# Altium schematic sheet BMS_MAINBOARD.SchDoc
size D
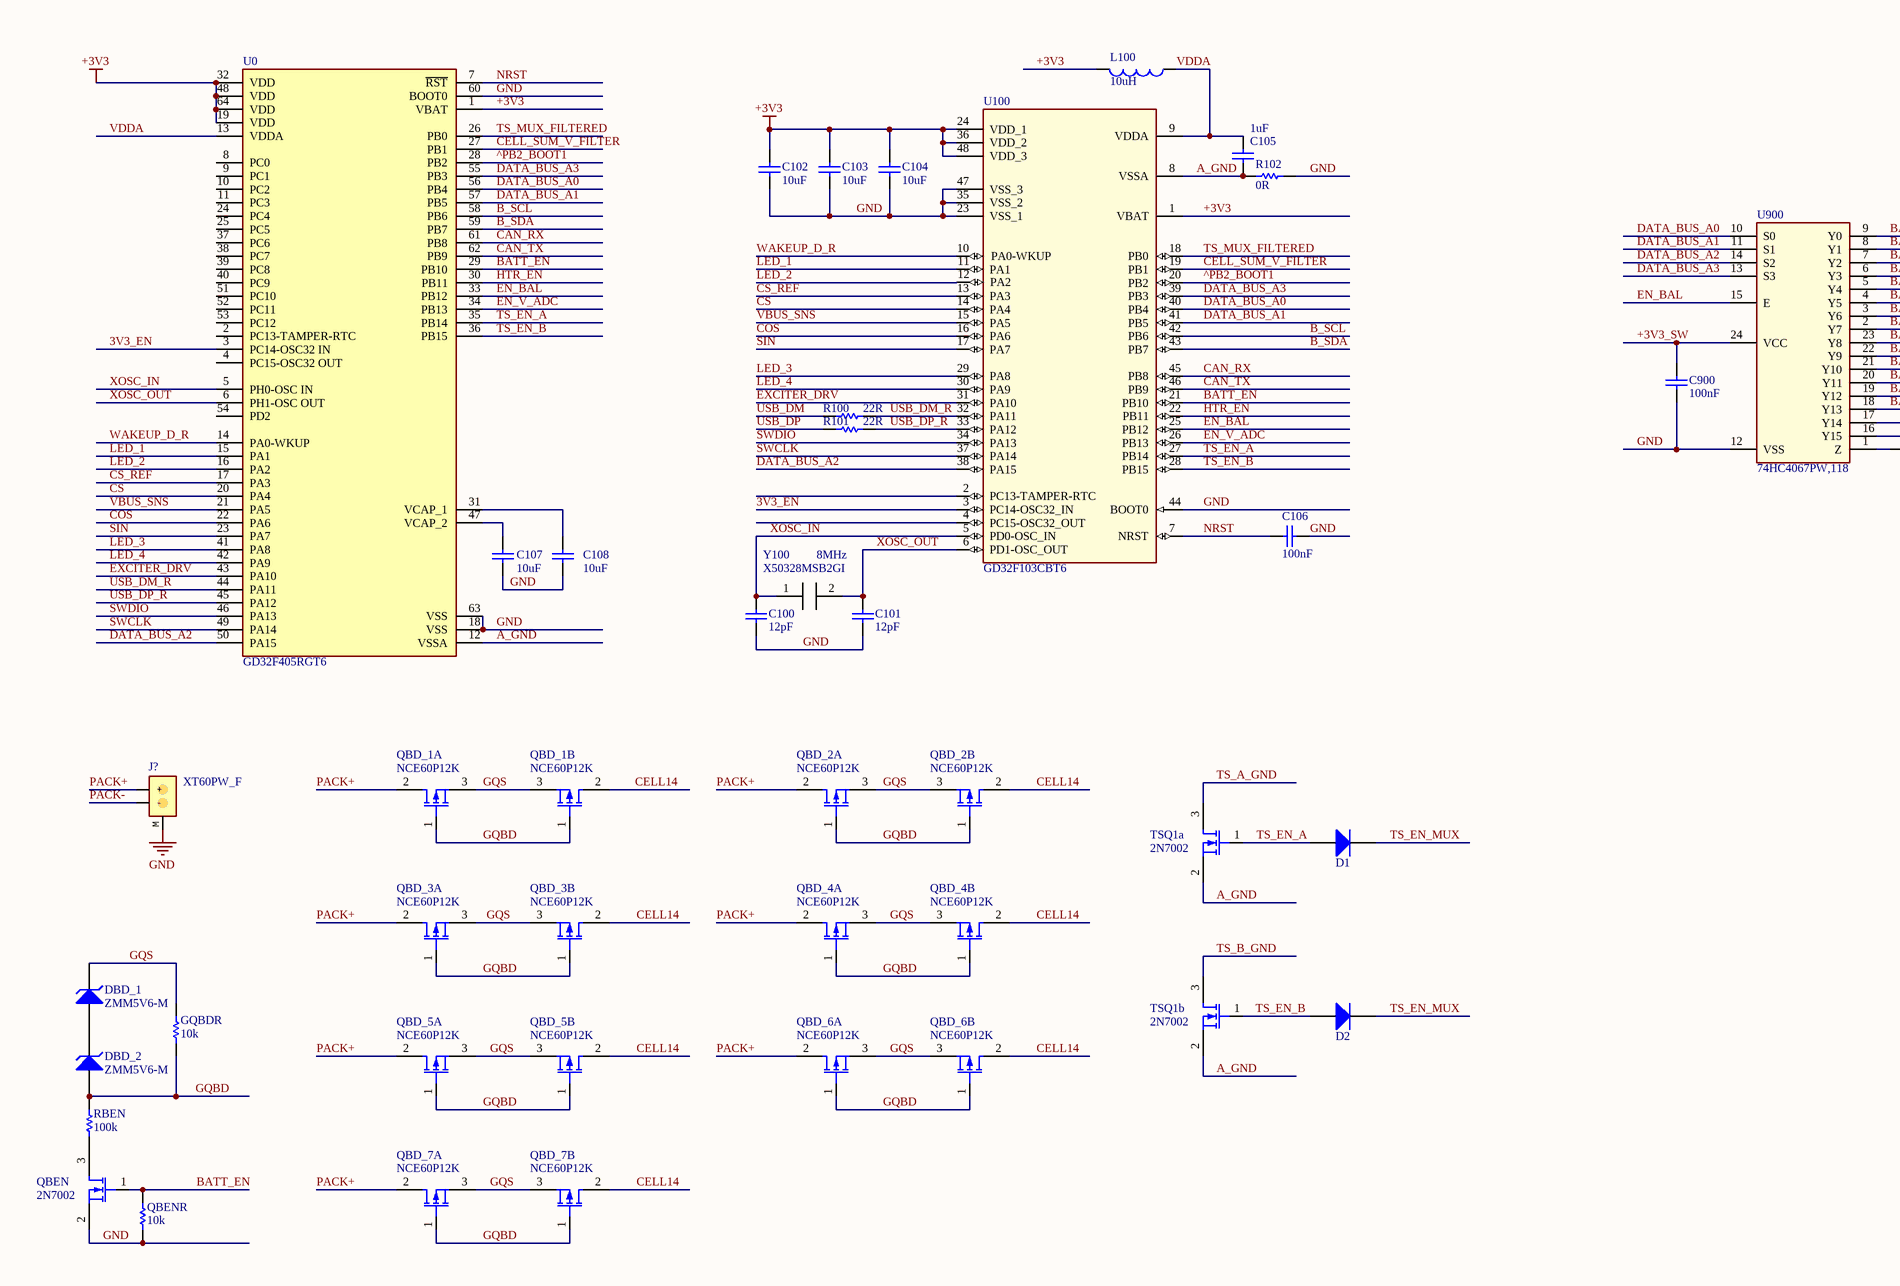
[diagram p0: BMS_MAINBOARD.SchDoc, top left]
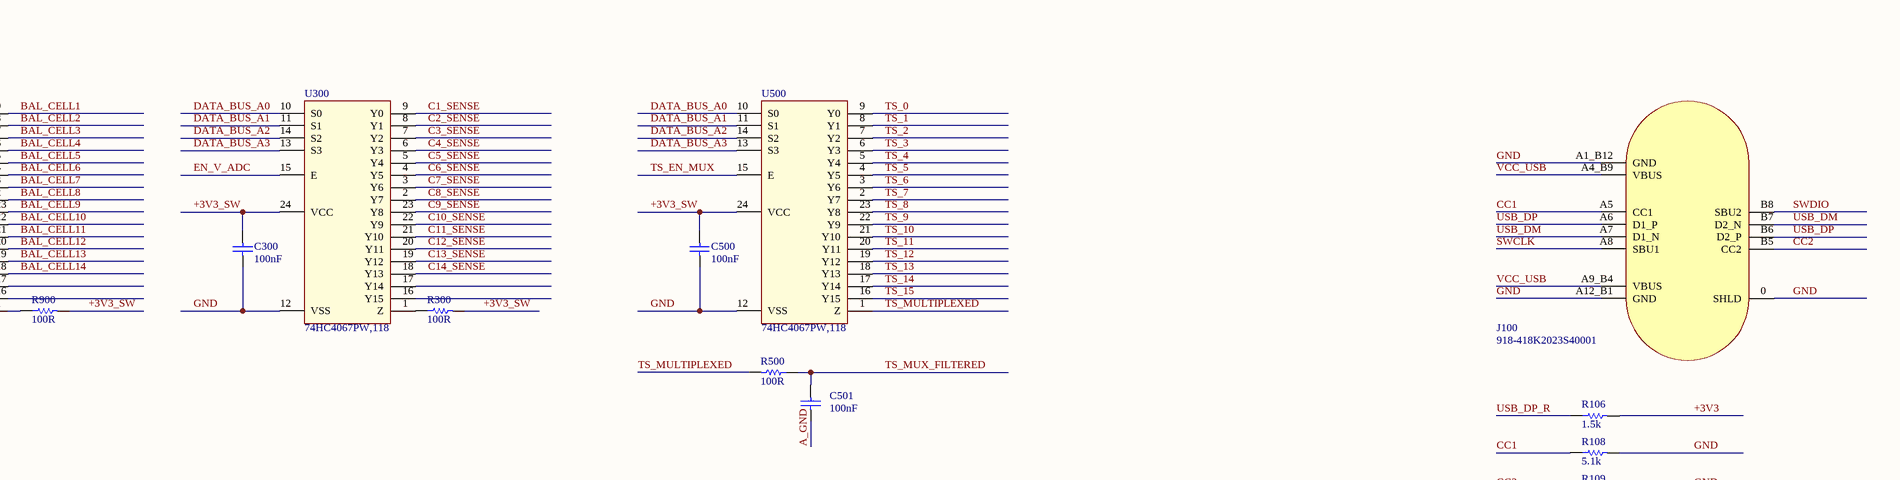
[diagram p1: BMS_MAINBOARD.SchDoc, top right]
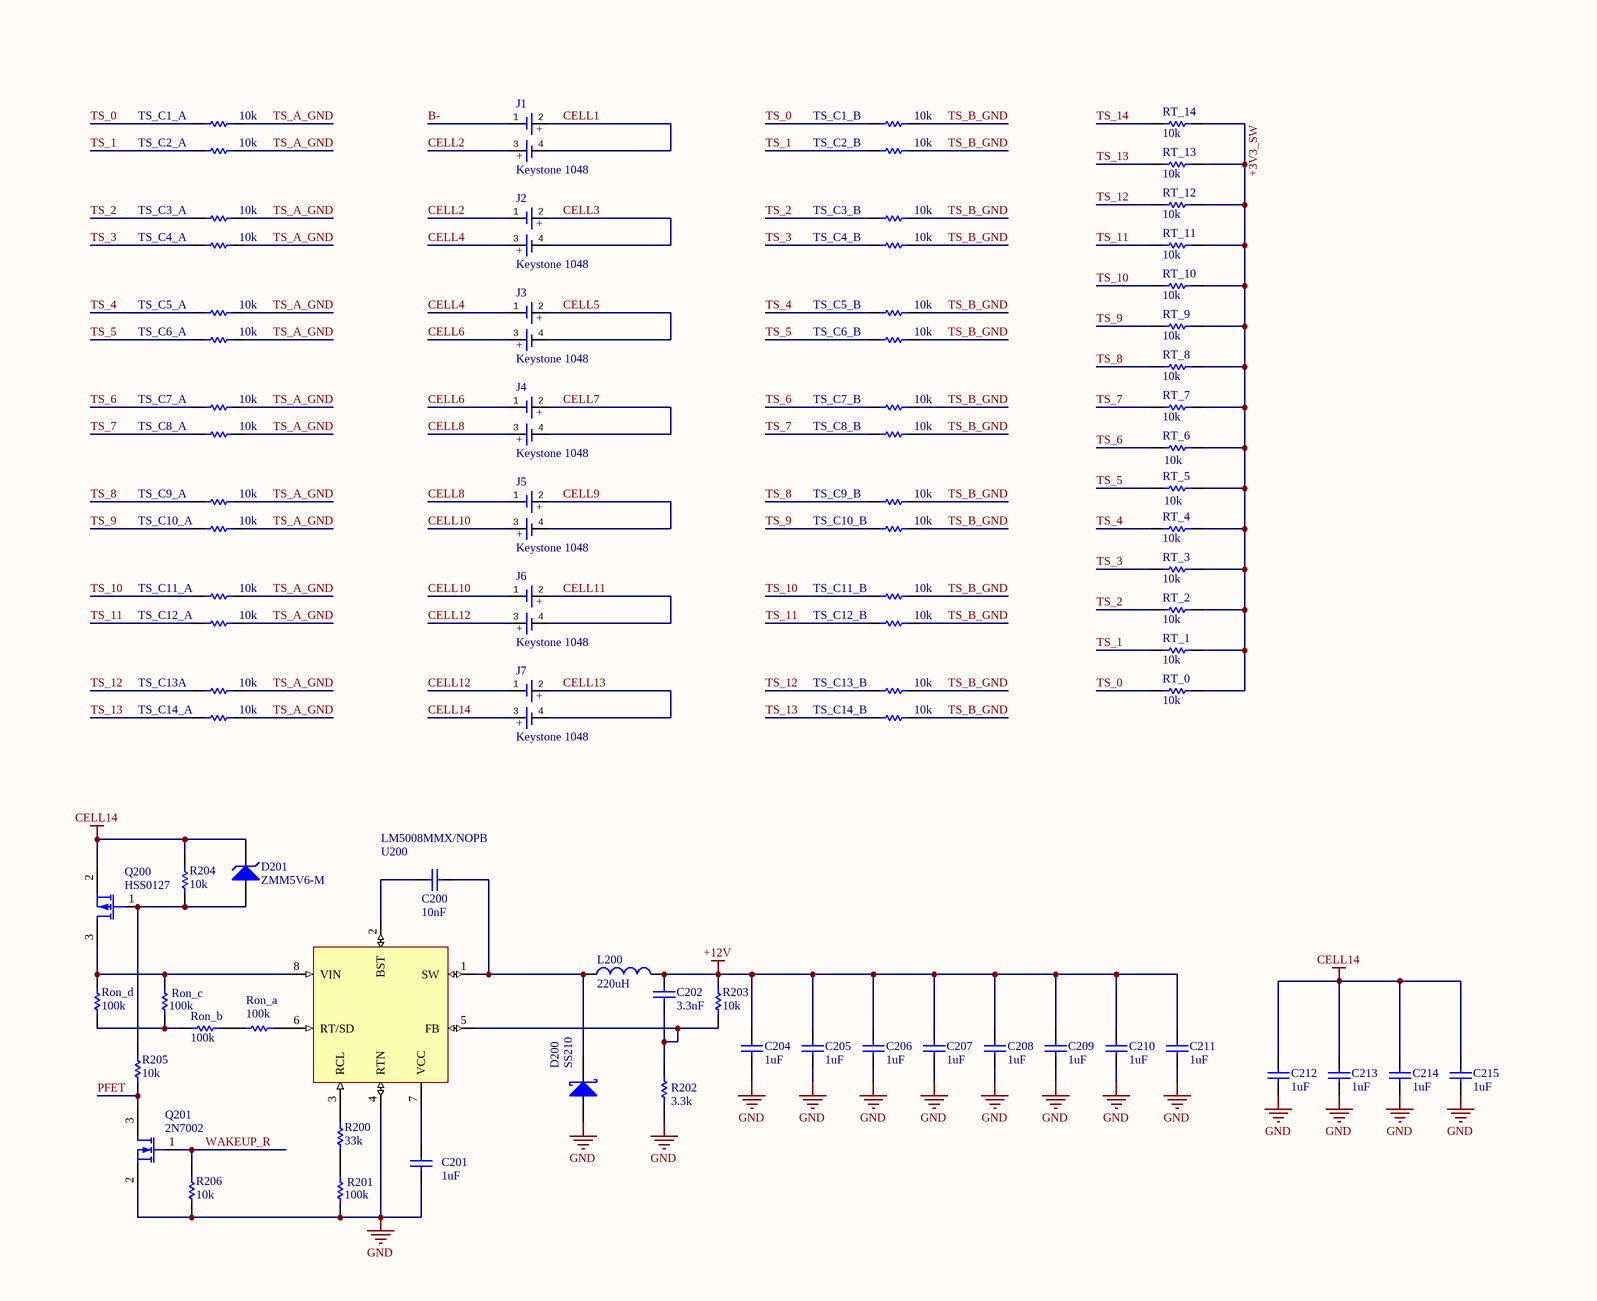
[diagram p2: BMS_MAINBOARD.SchDoc, bottom left]
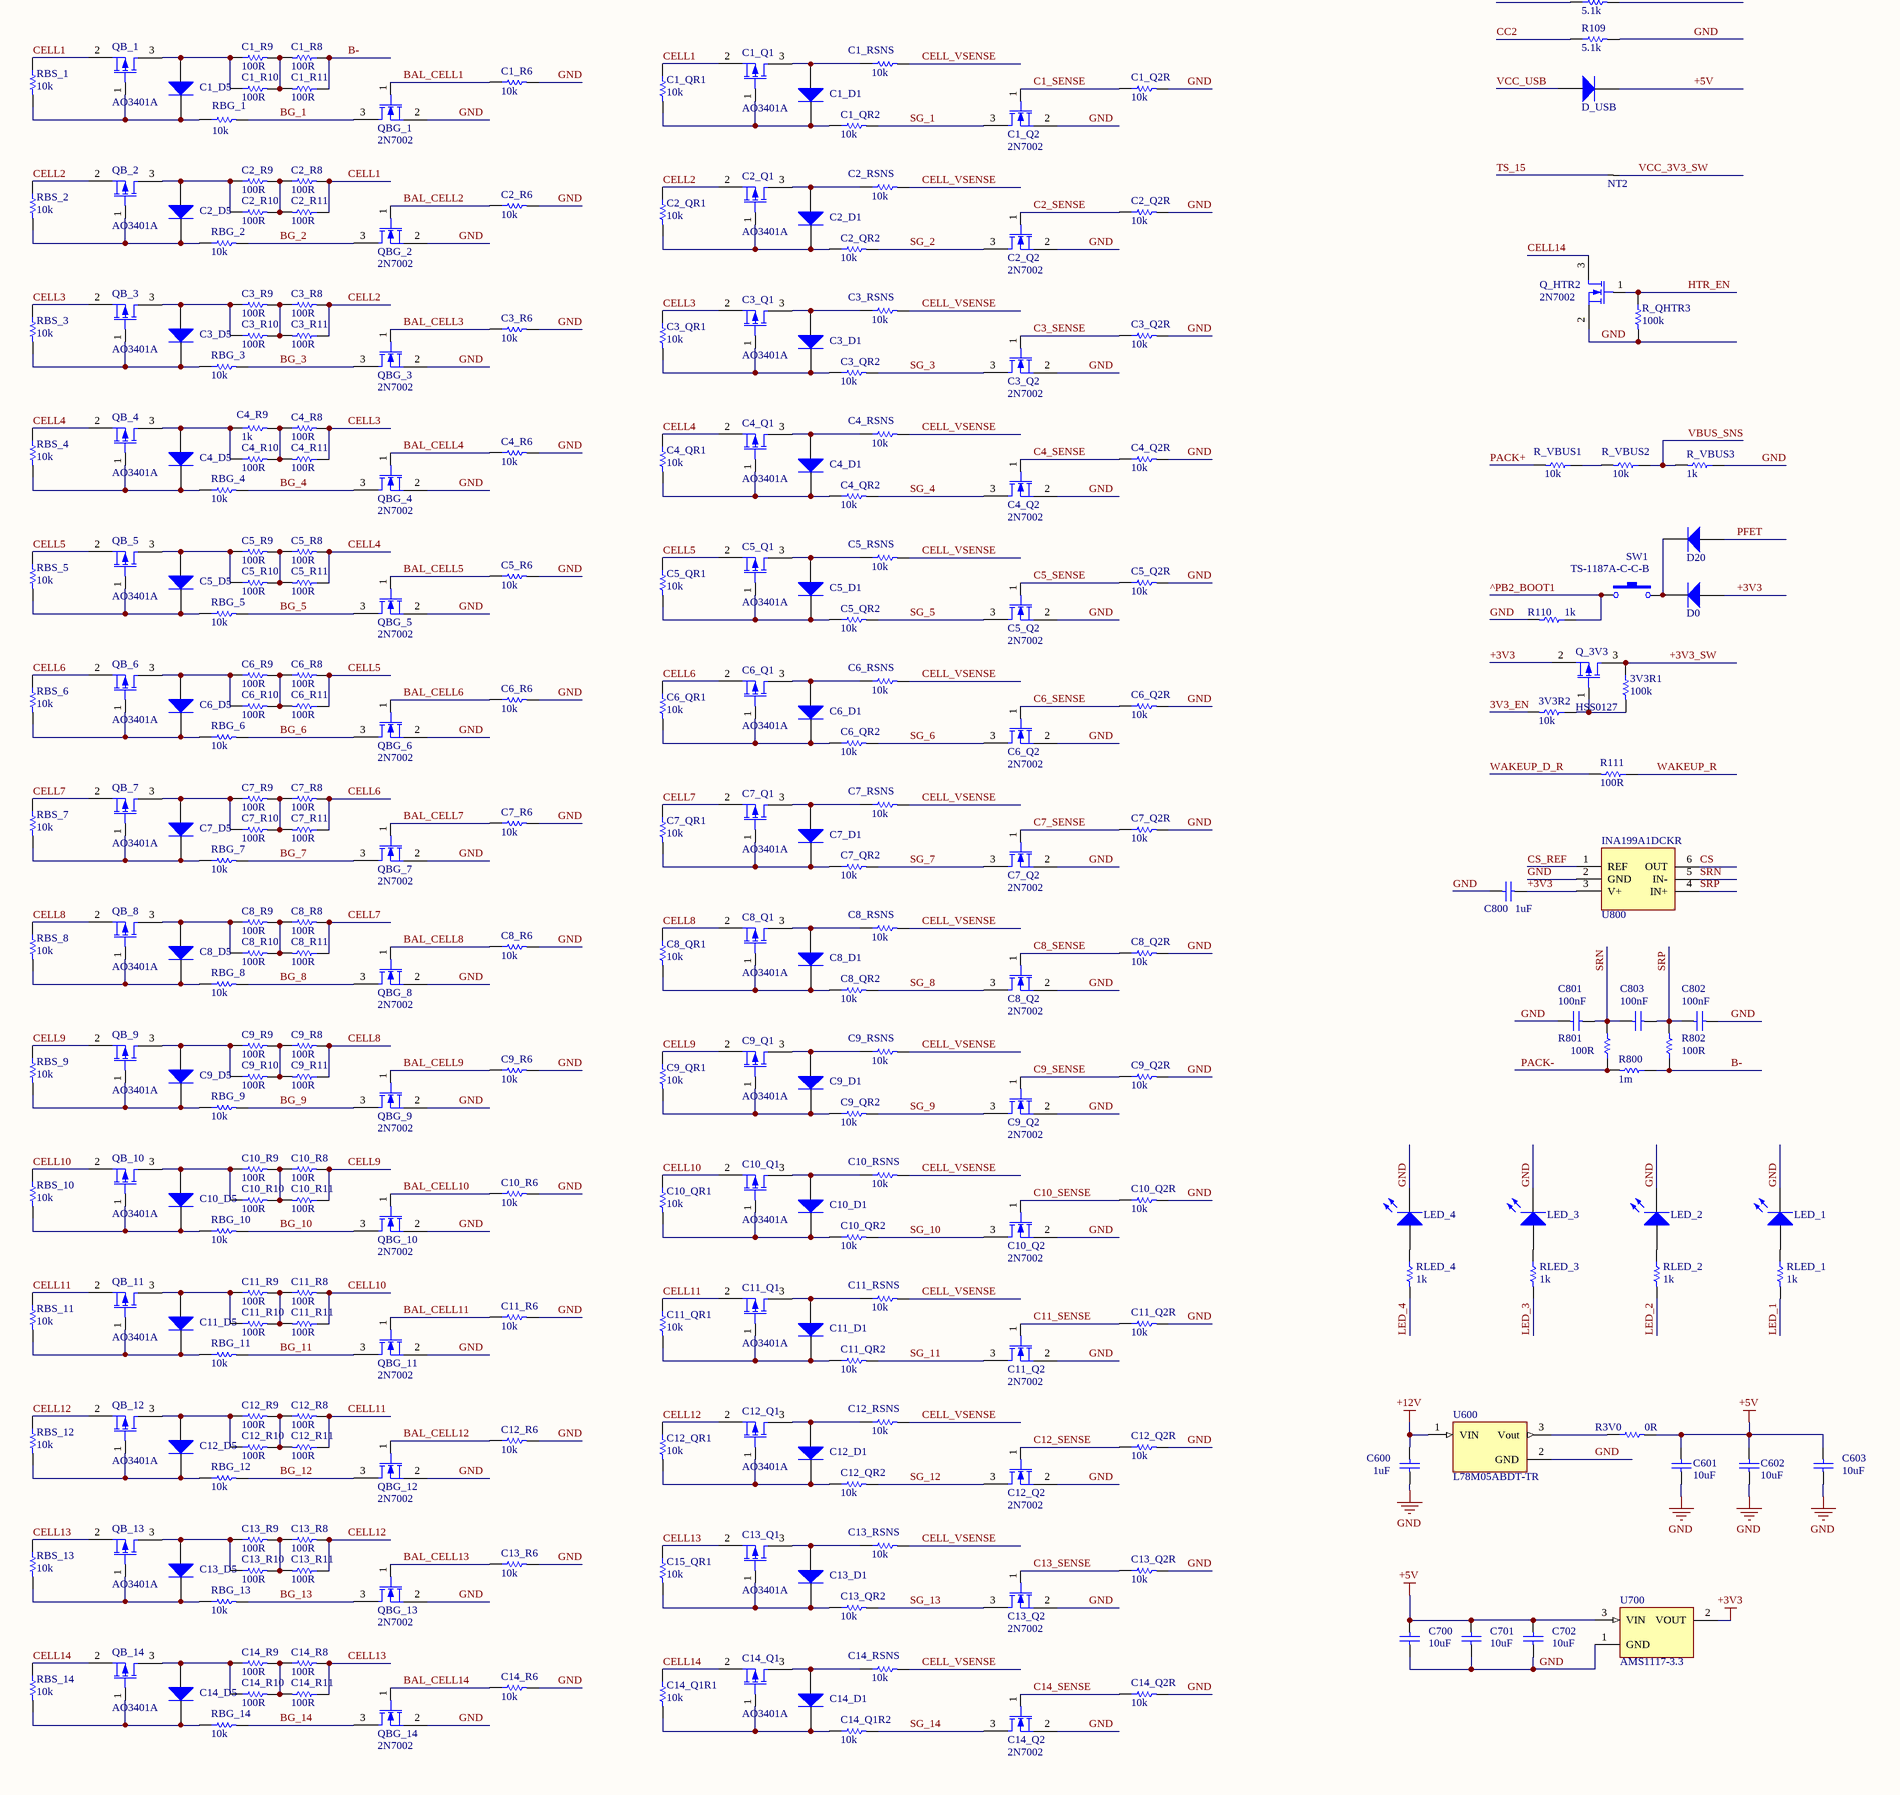
[diagram p3: BMS_MAINBOARD.SchDoc, bottom right]

## Parts
3V3R1  value 100k  [R_0402]  (hidden comment: 0402WGF1003TCE)
3V3R2  value 10k  [R_0402]  (hidden comment: 0402WGF1002TCE)
C1_D1  1N4148WS  [SOD-323]  (value not drawn)
C1_D5  1N4148WS  [SOD-323]  (value not drawn)
C1_Q1  AO3401A  [TO-236AB]
C1_Q2  2N7002  [TO-236AB]
C1_Q2R  value 10k  [R_0402]  (hidden comment: 0402WGF1002TCE)
C1_QR1  value 10k  [R_0402]  (hidden comment: 0402WGF1002TCE)
C1_QR2  value 10k  [R_0402]  (hidden comment: 0402WGF1002TCE)
C1_R6  value 10k  [R_0402]  (hidden comment: 0402WGF1002TCE)
C1_R8  value 100R  [R_0402]  (hidden comment: 0402WGF1000TCE)
C1_R9  value 100R  [R_0402]  (hidden comment: 0402WGF1000TCE)
C1_R10  value 100R  [R_0402]  (hidden comment: 0402WGF1000TCE)
C1_R11  value 100R  [R_0402]  (hidden comment: 0402WGF1000TCE)
C1_RSNS  value 10k  [R_0402]  (hidden comment: 0402WGF1002TCE)
C2_D1  1N4148WS  [SOD-323]  (value not drawn)
C2_D5  1N4148WS  [SOD-323]  (value not drawn)
C2_Q1  AO3401A  [TO-236AB]
C2_Q2  2N7002  [TO-236AB]
C2_Q2R  value 10k  [R_0402]  (hidden comment: 0402WGF1002TCE)
C2_QR1  value 10k  [R_0402]  (hidden comment: 0402WGF1002TCE)
C2_QR2  value 10k  [R_0402]  (hidden comment: 0402WGF1002TCE)
C2_R6  value 10k  [R_0402]  (hidden comment: 0402WGF1002TCE)
C2_R8  value 100R  [R_0402]  (hidden comment: 0402WGF1000TCE)
C2_R9  value 100R  [R_0402]  (hidden comment: 0402WGF1000TCE)
C2_R10  value 100R  [R_0402]  (hidden comment: 0402WGF1000TCE)
C2_R11  value 100R  [R_0402]  (hidden comment: 0402WGF1000TCE)
C2_RSNS  value 10k  [R_0402]  (hidden comment: 0402WGF1002TCE)
C3_D1  1N4148WS  [SOD-323]  (value not drawn)
C3_D5  1N4148WS  [SOD-323]  (value not drawn)
C3_Q1  AO3401A  [TO-236AB]
C3_Q2  2N7002  [TO-236AB]
C3_Q2R  value 10k  [R_0402]  (hidden comment: 0402WGF1002TCE)
C3_QR1  value 10k  [R_0402]  (hidden comment: 0402WGF1002TCE)
C3_QR2  value 10k  [R_0402]  (hidden comment: 0402WGF1002TCE)
C3_R6  value 10k  [R_0402]  (hidden comment: 0402WGF1002TCE)
C3_R8  value 100R  [R_0402]  (hidden comment: 0402WGF1000TCE)
C3_R9  value 100R  [R_0402]  (hidden comment: 0402WGF1000TCE)
C3_R10  value 100R  [R_0402]  (hidden comment: 0402WGF1000TCE)
C3_R11  value 100R  [R_0402]  (hidden comment: 0402WGF1000TCE)
C3_RSNS  value 10k  [R_0402]  (hidden comment: 0402WGF1002TCE)
C4_D1  1N4148WS  [SOD-323]  (value not drawn)
C4_D5  1N4148WS  [SOD-323]  (value not drawn)
C4_Q1  AO3401A  [TO-236AB]
C4_Q2  2N7002  [TO-236AB]
C4_Q2R  value 10k  [R_0402]  (hidden comment: 0402WGF1002TCE)
C4_QR1  value 10k  [R_0402]  (hidden comment: 0402WGF1002TCE)
C4_QR2  value 10k  [R_0402]  (hidden comment: 0402WGF1002TCE)
C4_R6  value 10k  [R_0402]  (hidden comment: 0402WGF1002TCE)
C4_R8  value 100R  [R_0402]  (hidden comment: 0402WGF1000TCE)
C4_R9  value 1k  [R_0402]  (hidden comment: 0402WGF1001TCE)
C4_R10  value 100R  [R_0402]  (hidden comment: 0402WGF1000TCE)
C4_R11  value 100R  [R_0402]  (hidden comment: 0402WGF1000TCE)
C4_RSNS  value 10k  [R_0402]  (hidden comment: 0402WGF1002TCE)
C5_D1  1N4148WS  [SOD-323]  (value not drawn)
C5_D5  1N4148WS  [SOD-323]  (value not drawn)
C5_Q1  AO3401A  [TO-236AB]
C5_Q2  2N7002  [TO-236AB]
C5_Q2R  value 10k  [R_0402]  (hidden comment: 0402WGF1002TCE)
C5_QR1  value 10k  [R_0402]  (hidden comment: 0402WGF1002TCE)
C5_QR2  value 10k  [R_0402]  (hidden comment: 0402WGF1002TCE)
C5_R6  value 10k  [R_0402]  (hidden comment: 0402WGF1002TCE)
C5_R8  value 100R  [R_0402]  (hidden comment: 0402WGF1000TCE)
C5_R9  value 100R  [R_0402]  (hidden comment: 0402WGF1000TCE)
C5_R10  value 100R  [R_0402]  (hidden comment: 0402WGF1000TCE)
C5_R11  value 100R  [R_0402]  (hidden comment: 0402WGF1000TCE)
C5_RSNS  value 10k  [R_0402]  (hidden comment: 0402WGF1002TCE)
C6_D1  1N4148WS  [SOD-323]  (value not drawn)
C6_D5  1N4148WS  [SOD-323]  (value not drawn)
C6_Q1  AO3401A  [TO-236AB]
C6_Q2  2N7002  [TO-236AB]
C6_Q2R  value 10k  [R_0402]  (hidden comment: 0402WGF1002TCE)
C6_QR1  value 10k  [R_0402]  (hidden comment: 0402WGF1002TCE)
C6_QR2  value 10k  [R_0402]  (hidden comment: 0402WGF1002TCE)
C6_R6  value 10k  [R_0402]  (hidden comment: 0402WGF1002TCE)
C6_R8  value 100R  [R_0402]  (hidden comment: 0402WGF1000TCE)
C6_R9  value 100R  [R_0402]  (hidden comment: 0402WGF1000TCE)
C6_R10  value 100R  [R_0402]  (hidden comment: 0402WGF1000TCE)
C6_R11  value 100R  [R_0402]  (hidden comment: 0402WGF1000TCE)
C6_RSNS  value 10k  [R_0402]  (hidden comment: 0402WGF1002TCE)
C7_D1  1N4148WS  [SOD-323]  (value not drawn)
C7_D5  1N4148WS  [SOD-323]  (value not drawn)
C7_Q1  AO3401A  [TO-236AB]
C7_Q2  2N7002  [TO-236AB]
C7_Q2R  value 10k  [R_0402]  (hidden comment: 0402WGF1002TCE)
C7_QR1  value 10k  [R_0402]  (hidden comment: 0402WGF1002TCE)
C7_QR2  value 10k  [R_0402]  (hidden comment: 0402WGF1002TCE)
C7_R6  value 10k  [R_0402]  (hidden comment: 0402WGF1002TCE)
C7_R8  value 100R  [R_0402]  (hidden comment: 0402WGF1000TCE)
C7_R9  value 100R  [R_0402]  (hidden comment: 0402WGF1000TCE)
C7_R10  value 100R  [R_0402]  (hidden comment: 0402WGF1000TCE)
C7_R11  value 100R  [R_0402]  (hidden comment: 0402WGF1000TCE)
C7_RSNS  value 10k  [R_0402]  (hidden comment: 0402WGF1002TCE)
C8_D1  1N4148WS  [SOD-323]  (value not drawn)
C8_D5  1N4148WS  [SOD-323]  (value not drawn)
C8_Q1  AO3401A  [TO-236AB]
C8_Q2  2N7002  [TO-236AB]
C8_Q2R  value 10k  [R_0402]  (hidden comment: 0402WGF1002TCE)
C8_QR1  value 10k  [R_0402]  (hidden comment: 0402WGF1002TCE)
C8_QR2  value 10k  [R_0402]  (hidden comment: 0402WGF1002TCE)
C8_R6  value 10k  [R_0402]  (hidden comment: 0402WGF1002TCE)
C8_R8  value 100R  [R_0402]  (hidden comment: 0402WGF1000TCE)
C8_R9  value 100R  [R_0402]  (hidden comment: 0402WGF1000TCE)
C8_R10  value 100R  [R_0402]  (hidden comment: 0402WGF1000TCE)
C8_R11  value 100R  [R_0402]  (hidden comment: 0402WGF1000TCE)
C8_RSNS  value 10k  [R_0402]  (hidden comment: 0402WGF1002TCE)
C9_D1  1N4148WS  [SOD-323]  (value not drawn)
C9_D5  1N4148WS  [SOD-323]  (value not drawn)
C9_Q1  AO3401A  [TO-236AB]
C9_Q2  2N7002  [TO-236AB]
C9_Q2R  value 10k  [R_0402]  (hidden comment: 0402WGF1002TCE)
C9_QR1  value 10k  [R_0402]  (hidden comment: 0402WGF1002TCE)
C9_QR2  value 10k  [R_0402]  (hidden comment: 0402WGF1002TCE)
C9_R6  value 10k  [R_0402]  (hidden comment: 0402WGF1002TCE)
C9_R8  value 100R  [R_0402]  (hidden comment: 0402WGF1000TCE)
C9_R9  value 100R  [R_0402]  (hidden comment: 0402WGF1000TCE)
C9_R10  value 100R  [R_0402]  (hidden comment: 0402WGF1000TCE)
C9_R11  value 100R  [R_0402]  (hidden comment: 0402WGF1000TCE)
C9_RSNS  value 10k  [R_0402]  (hidden comment: 0402WGF1002TCE)
C10_D1  1N4148WS  [SOD-323]  (value not drawn)
C10_D5  1N4148WS  [SOD-323]  (value not drawn)
C10_Q1  AO3401A  [TO-236AB]
C10_Q2  2N7002  [TO-236AB]
C10_Q2R  value 10k  [R_0402]  (hidden comment: 0402WGF1002TCE)
C10_QR1  value 10k  [R_0402]  (hidden comment: 0402WGF1002TCE)
C10_QR2  value 10k  [R_0402]  (hidden comment: 0402WGF1002TCE)
C10_R6  value 10k  [R_0402]  (hidden comment: 0402WGF1002TCE)
C10_R8  value 100R  [R_0402]  (hidden comment: 0402WGF1000TCE)
C10_R9  value 100R  [R_0402]  (hidden comment: 0402WGF1000TCE)
C10_R10  value 100R  [R_0402]  (hidden comment: 0402WGF1000TCE)
C10_R11  value 100R  [R_0402]  (hidden comment: 0402WGF1000TCE)
C10_RSNS  value 10k  [R_0402]  (hidden comment: 0402WGF1002TCE)
C11_D1  1N4148WS  [SOD-323]  (value not drawn)
C11_D5  1N4148WS  [SOD-323]  (value not drawn)
C11_Q1  AO3401A  [TO-236AB]
C11_Q2  2N7002  [TO-236AB]
C11_Q2R  value 10k  [R_0402]  (hidden comment: 0402WGF1002TCE)
C11_QR1  value 10k  [R_0402]  (hidden comment: 0402WGF1002TCE)
C11_QR2  value 10k  [R_0402]  (hidden comment: 0402WGF1002TCE)
C11_R6  value 10k  [R_0402]  (hidden comment: 0402WGF1002TCE)
C11_R8  value 100R  [R_0402]  (hidden comment: 0402WGF1000TCE)
C11_R9  value 100R  [R_0402]  (hidden comment: 0402WGF1000TCE)
C11_R10  value 100R  [R_0402]  (hidden comment: 0402WGF1000TCE)
C11_R11  value 100R  [R_0402]  (hidden comment: 0402WGF1000TCE)
C11_RSNS  value 10k  [R_0402]  (hidden comment: 0402WGF1002TCE)
C12_D1  1N4148WS  [SOD-323]  (value not drawn)
C12_D5  1N4148WS  [SOD-323]  (value not drawn)
C12_Q1  AO3401A  [TO-236AB]
C12_Q2  2N7002  [TO-236AB]
C12_Q2R  value 10k  [R_0402]  (hidden comment: 0402WGF1002TCE)
C12_QR1  value 10k  [R_0402]  (hidden comment: 0402WGF1002TCE)
C12_QR2  value 10k  [R_0402]  (hidden comment: 0402WGF1002TCE)
C12_R6  value 10k  [R_0402]  (hidden comment: 0402WGF1002TCE)
C12_R8  value 100R  [R_0402]  (hidden comment: 0402WGF1000TCE)
C12_R9  value 100R  [R_0402]  (hidden comment: 0402WGF1000TCE)
C12_R10  value 100R  [R_0402]  (hidden comment: 0402WGF1000TCE)
C12_R11  value 100R  [R_0402]  (hidden comment: 0402WGF1000TCE)
C12_RSNS  value 10k  [R_0402]  (hidden comment: 0402WGF1002TCE)
C13_D1  1N4148WS  [SOD-323]  (value not drawn)
C13_D5  1N4148WS  [SOD-323]  (value not drawn)
C13_Q1  AO3401A  [TO-236AB]
C13_Q2  2N7002  [TO-236AB]
C13_Q2R  value 10k  [R_0402]  (hidden comment: 0402WGF1002TCE)
C13_QR2  value 10k  [R_0402]  (hidden comment: 0402WGF1002TCE)
C13_R6  value 10k  [R_0402]  (hidden comment: 0402WGF1002TCE)
C13_R8  value 100R  [R_0402]  (hidden comment: 0402WGF1000TCE)
C13_R9  value 100R  [R_0402]  (hidden comment: 0402WGF1000TCE)
C13_R10  value 100R  [R_0402]  (hidden comment: 0402WGF1000TCE)
C13_R11  value 100R  [R_0402]  (hidden comment: 0402WGF1000TCE)
C13_RSNS  value 10k  [R_0402]  (hidden comment: 0402WGF1002TCE)
C14_D1  1N4148WS  [SOD-323]  (value not drawn)
C14_D5  1N4148WS  [SOD-323]  (value not drawn)
C14_Q1  AO3401A  [TO-236AB]
C14_Q1R1  value 10k  [R_0402]  (hidden comment: 0402WGF1002TCE)
C14_Q1R2  value 10k  [R_0402]  (hidden comment: 0402WGF1002TCE)
C14_Q2  2N7002  [TO-236AB]
C14_Q2R  value 10k  [R_0402]  (hidden comment: 0402WGF1002TCE)
C14_R6  value 10k  [R_0402]  (hidden comment: 0402WGF1002TCE)
C14_R8  value 100R  [R_0402]  (hidden comment: 0402WGF1000TCE)
C14_R9  value 100R  [R_0402]  (hidden comment: 0402WGF1000TCE)
C14_R10  value 100R  [R_0402]  (hidden comment: 0402WGF1000TCE)
C14_R11  value 100R  [R_0402]  (hidden comment: 0402WGF1000TCE)
C14_RSNS  value 10k  [R_0402]  (hidden comment: 0402WGF1002TCE)
C15_QR1  value 10k  [R_0402]  (hidden comment: 0402WGF1002TCE)
C100  value 12pF  [C_0402]  (hidden comment: 0402CG120J500NT)
C101  value 12pF  [C_0402]  (hidden comment: 0402CG120J500NT)
C102  value 10uF  [C_0402]  (hidden comment: CL05A106MQ5NUNC)
C103  value 10uF  [C_0402]  (hidden comment: CL05A106MQ5NUNC)
C104  value 10uF  [C_0402]  (hidden comment: CL05A106MQ5NUNC)
C105  value 1uF  [C_0402]  (hidden comment: CL05A105KA5NQNC)
C106  value 100nF  [C_0402]  (hidden comment: CL05B104KO5NNNC)
C107  value 10uF  [C_0402]  (hidden comment: CL05A106MQ5NUNC)
C108  value 10uF  [C_0402]  (hidden comment: CL05A106MQ5NUNC)
C200  value 10nF  [C_0402]  (hidden comment: CL05B103KB5NNNC)
C201  value 1uF  [C_0402]  (hidden comment: CL05A105KA5NQNC)
C202  value 3.3nF  [C_0402]  (hidden comment: CL05B332KB5NNNC)
C204  value 1uF  [C_0402]  (hidden comment: CL05A105KA5NQNC)
C205  value 1uF  [C_0402]  (hidden comment: CL05A105KA5NQNC)
C206  value 1uF  [C_0402]  (hidden comment: CL05A105KA5NQNC)
C207  value 1uF  [C_0402]  (hidden comment: CL05A105KA5NQNC)
C208  value 1uF  [C_0402]  (hidden comment: CL05A105KA5NQNC)
C209  value 1uF  [C_0402]  (hidden comment: CL05A105KA5NQNC)
C210  value 1uF  [C_0402]  (hidden comment: CL05A105KA5NQNC)
C211  value 1uF  [C_0402]  (hidden comment: CL05A105KA5NQNC)
C212  value 1uF  [C_1206]  (hidden comment: 1206B105K101NT)
C213  value 1uF  [C_1206]  (hidden comment: 1206B105K101NT)
C214  value 1uF  [C_1206]  (hidden comment: 1206B105K101NT)
C215  value 1uF  [C_1206]  (hidden comment: 1206B105K101NT)
C300  value 100nF  [C_0402]  (hidden comment: CL05B104KO5NNNC)
C500  value 100nF  [C_0402]  (hidden comment: CL05B104KO5NNNC)
C501  value 100nF  [C_0402]  (hidden comment: CL05B104KO5NNNC)
C600  value 1uF  [C_0402]  (hidden comment: CL05A105KA5NQNC)
C601  value 10uF  [C_0402]  (hidden comment: CL05A106MQ5NUNC)
C602  value 10uF  [C_0402]  (hidden comment: CL05A106MQ5NUNC)
C603  value 10uF  [C_0402]  (hidden comment: CL05A106MQ5NUNC)
C700  value 10uF  [C_0402]  (hidden comment: CL05A106MQ5NUNC)
C701  value 10uF  [C_0402]  (hidden comment: CL05A106MQ5NUNC)
C702  value 10uF  [C_0402]  (hidden comment: CL05A106MQ5NUNC)
C800  value 1uF  [C_0402]  (hidden comment: CL05A105KA5NQNC)
C801  value 100nF  [C_0402]  (hidden comment: CL05B104KO5NNNC)
C802  value 100nF  [C_0402]  (hidden comment: CL05B104KO5NNNC)
C803  value 100nF  [C_0402]  (hidden comment: CL05B104KO5NNNC)
C900  value 100nF  [C_0402]  (hidden comment: CL05B104KO5NNNC)
D0  1N4148WS  [SOD-323]  (value not drawn)
D1  1N4148WS  [SOD-323]  (value not drawn)
D2  1N4148WS  [SOD-323]  (value not drawn)
D20  1N4148WS  [SOD-323]  (value not drawn)
D200  SS210  [DO-214AC]
D201  ZMM5V6-M  [DO-213AA]
D_USB  1N4148WS  [SOD-323]  (value not drawn)
DBD_1  ZMM5V6-M  [DO-213AA]
DBD_2  ZMM5V6-M  [DO-213AA]
GQBDR  value 10k  [R_0402]  (hidden comment: 0402WGF1002TCE)
J1  Keystone 1048  [Keystone 1048]
J2  Keystone 1048  [Keystone 1048]
J3  Keystone 1048  [Keystone 1048]
J4  Keystone 1048  [Keystone 1048]
J5  Keystone 1048  [Keystone 1048]
J6  Keystone 1048  [Keystone 1048]
J7  Keystone 1048  [Keystone 1048]
J100  918-418K2023S40001  [DX07S016JA1R1500]
J?  XT60PW_F  [XT60PW_F]
L100  value 10uH  [L_0603]  (hidden comment: SDFL1608S100KTF)
L200  value 220uH  [SRR1260]  (hidden comment: SWRB1207S-221MT)
LED_1  19-21UYC/S530-A4/TR8  [D_0603]  (value not drawn)
LED_2  19-21UYC/S530-A4/TR8  [D_0603]  (value not drawn)
LED_3  19-21UYC/S530-A4/TR8  [D_0603]  (value not drawn)
LED_4  19-21UYC/S530-A4/TR8  [D_0603]  (value not drawn)
NT2  0  [NET_TIE]  (value not drawn)
Q200  HSS0127  [TO-236AB]
Q201  2N7002  [TO-236AB]
Q_3V3  HSS0127  [TO-236AB]
Q_HTR2  2N7002  [TO-236AB]
QB_1  AO3401A  [TO-236AB]
QB_2  AO3401A  [TO-236AB]
QB_3  AO3401A  [TO-236AB]
QB_4  AO3401A  [TO-236AB]
QB_5  AO3401A  [TO-236AB]
QB_6  AO3401A  [TO-236AB]
QB_7  AO3401A  [TO-236AB]
QB_8  AO3401A  [TO-236AB]
QB_9  AO3401A  [TO-236AB]
QB_10  AO3401A  [TO-236AB]
QB_11  AO3401A  [TO-236AB]
QB_12  AO3401A  [TO-236AB]
QB_13  AO3401A  [TO-236AB]
QB_14  AO3401A  [TO-236AB]
QBD_1A  NCE60P12K  [TO-252AA]
QBD_1B  NCE60P12K  [TO-252AA]
QBD_2A  NCE60P12K  [TO-252AA]
QBD_2B  NCE60P12K  [TO-252AA]
QBD_3A  NCE60P12K  [TO-252AA]
QBD_3B  NCE60P12K  [TO-252AA]
QBD_4A  NCE60P12K  [TO-252AA]
QBD_4B  NCE60P12K  [TO-252AA]
QBD_5A  NCE60P12K  [TO-252AA]
QBD_5B  NCE60P12K  [TO-252AA]
QBD_6A  NCE60P12K  [TO-252AA]
QBD_6B  NCE60P12K  [TO-252AA]
QBD_7A  NCE60P12K  [TO-252AA]
QBD_7B  NCE60P12K  [TO-252AA]
QBEN  2N7002  [TO-236AB]
QBENR  value 10k  [R_0402]  (hidden comment: 0402WGF1002TCE)
QBG_1  2N7002  [TO-236AB]
QBG_2  2N7002  [TO-236AB]
QBG_3  2N7002  [TO-236AB]
QBG_4  2N7002  [TO-236AB]
QBG_5  2N7002  [TO-236AB]
QBG_6  2N7002  [TO-236AB]
QBG_7  2N7002  [TO-236AB]
QBG_8  2N7002  [TO-236AB]
QBG_9  2N7002  [TO-236AB]
QBG_10  2N7002  [TO-236AB]
QBG_11  2N7002  [TO-236AB]
QBG_12  2N7002  [TO-236AB]
QBG_13  2N7002  [TO-236AB]
QBG_14  2N7002  [TO-236AB]
R3V0  value 0R  [R_0402]  (hidden comment: 0402WGF0000TCE)
R100  value 22R  [R_0402]  (hidden comment: 0402WGF220JTCE)
R101  value 22R  [R_0402]  (hidden comment: 0402WGF220JTCE)
R102  value 0R  [R_0402]  (hidden comment: 0402WGF0000TCE)
R106  value 1.5k  [R_0402]  (hidden comment: 0402WGF1501TCE)
R108  value 5.1k  [R_0402]  (hidden comment: 0402WGF5101TCE)
R109  value 5.1k  [R_0402]  (hidden comment: 0402WGF5101TCE)
R110  value 1k  [R_0402]  (hidden comment: 0402WGF1001TCE)
R111  value 100R  [R_0402]  (hidden comment: 0402WGF1000TCE)
R200  value 33k  [R_0402]  (hidden comment: 0402WGF3302TCE)
R201  value 100k  [R_0402]  (hidden comment: 0402WGF1003TCE)
R202  value 3.3k  [R_0402]  (hidden comment: 0402WGF3301TCE)
R203  value 10k  [R_0402]  (hidden comment: 0402WGF1002TCE)
R204  value 10k  [R_0402]  (hidden comment: 0402WGF1002TCE)
R205  value 10k  [R_0402]  (hidden comment: 0402WGF1002TCE)
R206  value 10k  [R_0402]  (hidden comment: 0402WGF1002TCE)
R300  value 100R  [R_0402]  (hidden comment: 0402WGF1000TCE)
R500  value 100R  [R_0402]  (hidden comment: 0402WGF1000TCE)
R800  1m  [R_2512]
R801  value 100R  [R_0402]  (hidden comment: 0402WGF1000TCE)
R802  value 100R  [R_0402]  (hidden comment: 0402WGF1000TCE)
R900  value 100R  [R_0402]  (hidden comment: 0402WGF1000TCE)
R_QHTR3  value 100k  [R_0402]  (hidden comment: 0402WGF1003TCE)
R_VBUS1  value 10k  [R_0402]  (hidden comment: 0402WGF1002TCE)
R_VBUS2  value 10k  [R_0402]  (hidden comment: 0402WGF1002TCE)
R_VBUS3  value 1k  [R_0402]  (hidden comment: 0402WGF1001TCE)
RBEN  value 100k  [R_0402]  (hidden comment: 0402WGF1003TCE)
RBG_1  value 10k  [R_0402]  (hidden comment: 0402WGF1002TCE)
RBG_2  value 10k  [R_0402]  (hidden comment: 0402WGF1002TCE)
RBG_3  value 10k  [R_0402]  (hidden comment: 0402WGF1002TCE)
RBG_4  value 10k  [R_0402]  (hidden comment: 0402WGF1002TCE)
RBG_5  value 10k  [R_0402]  (hidden comment: 0402WGF1002TCE)
RBG_6  value 10k  [R_0402]  (hidden comment: 0402WGF1002TCE)
RBG_7  value 10k  [R_0402]  (hidden comment: 0402WGF1002TCE)
RBG_8  value 10k  [R_0402]  (hidden comment: 0402WGF1002TCE)
RBG_9  value 10k  [R_0402]  (hidden comment: 0402WGF1002TCE)
RBG_10  value 10k  [R_0402]  (hidden comment: 0402WGF1002TCE)
RBG_11  value 10k  [R_0402]  (hidden comment: 0402WGF1002TCE)
RBG_12  value 10k  [R_0402]  (hidden comment: 0402WGF1002TCE)
RBG_13  value 10k  [R_0402]  (hidden comment: 0402WGF1002TCE)
RBG_14  value 10k  [R_0402]  (hidden comment: 0402WGF1002TCE)
RBS_1  value 10k  [R_0402]  (hidden comment: 0402WGF1002TCE)
RBS_2  value 10k  [R_0402]  (hidden comment: 0402WGF1002TCE)
RBS_3  value 10k  [R_0402]  (hidden comment: 0402WGF1002TCE)
RBS_4  value 10k  [R_0402]  (hidden comment: 0402WGF1002TCE)
RBS_5  value 10k  [R_0402]  (hidden comment: 0402WGF1002TCE)
RBS_6  value 10k  [R_0402]  (hidden comment: 0402WGF1002TCE)
RBS_7  value 10k  [R_0402]  (hidden comment: 0402WGF1002TCE)
RBS_8  value 10k  [R_0402]  (hidden comment: 0402WGF1002TCE)
RBS_9  value 10k  [R_0402]  (hidden comment: 0402WGF1002TCE)
RBS_10  value 10k  [R_0402]  (hidden comment: 0402WGF1002TCE)
RBS_11  value 10k  [R_0402]  (hidden comment: 0402WGF1002TCE)
RBS_12  value 10k  [R_0402]  (hidden comment: 0402WGF1002TCE)
RBS_13  value 10k  [R_0402]  (hidden comment: 0402WGF1002TCE)
RBS_14  value 10k  [R_0402]  (hidden comment: 0402WGF1002TCE)
RLED_1  value 1k  [R_0402]  (hidden comment: 0402WGF1001TCE)
RLED_2  value 1k  [R_0402]  (hidden comment: 0402WGF1001TCE)
RLED_3  value 1k  [R_0402]  (hidden comment: 0402WGF1001TCE)
RLED_4  value 1k  [R_0402]  (hidden comment: 0402WGF1001TCE)
Ron_a  value 100k  [R_0402]  (hidden comment: 0402WGF1003TCE)
Ron_b  value 100k  [R_0402]  (hidden comment: 0402WGF1003TCE)
Ron_c  value 100k  [R_0402]  (hidden comment: 0402WGF1003TCE)
Ron_d  value 100k  [R_0402]  (hidden comment: 0402WGF1003TCE)
RT_0  value 10k  [R_0402]  (hidden comment: 0402WGF1002TCE)
RT_1  value 10k  [R_0402]  (hidden comment: 0402WGF1002TCE)
RT_2  value 10k  [R_0402]  (hidden comment: 0402WGF1002TCE)
RT_3  value 10k  [R_0402]  (hidden comment: 0402WGF1002TCE)
RT_4  value 10k  [R_0402]  (hidden comment: 0402WGF1002TCE)
RT_5  value 10k  [R_0402]  (hidden comment: 0402WGF1002TCE)
RT_6  value 10k  [R_0402]  (hidden comment: 0402WGF1002TCE)
RT_7  value 10k  [R_0402]  (hidden comment: 0402WGF1002TCE)
RT_8  value 10k  [R_0402]  (hidden comment: 0402WGF1002TCE)
RT_9  value 10k  [R_0402]  (hidden comment: 0402WGF1002TCE)
RT_10  value 10k  [R_0402]  (hidden comment: 0402WGF1002TCE)
RT_11  value 10k  [R_0402]  (hidden comment: 0402WGF1002TCE)
RT_12  value 10k  [R_0402]  (hidden comment: 0402WGF1002TCE)
RT_13  value 10k  [R_0402]  (hidden comment: 0402WGF1002TCE)
RT_14  value 10k  [R_0402]  (hidden comment: 0402WGF1002TCE)
SW1  TS-1187A-C-C-B  [TS-1187A-C-C-B]
TS_C1_A  value 10k  [R_0402]  (hidden comment: NCP15XH103F03RC)
TS_C1_B  value 10k  [R_0402]  (hidden comment: NCP15XH103F03RC)
TS_C2_A  value 10k  [R_0402]  (hidden comment: NCP15XH103F03RC)
TS_C2_B  value 10k  [R_0402]  (hidden comment: NCP15XH103F03RC)
TS_C3_A  value 10k  [R_0402]  (hidden comment: NCP15XH103F03RC)
TS_C3_B  value 10k  [R_0402]  (hidden comment: NCP15XH103F03RC)
TS_C4_A  value 10k  [R_0402]  (hidden comment: NCP15XH103F03RC)
TS_C4_B  value 10k  [R_0402]  (hidden comment: NCP15XH103F03RC)
TS_C5_A  value 10k  [R_0402]  (hidden comment: NCP15XH103F03RC)
TS_C5_B  value 10k  [R_0402]  (hidden comment: NCP15XH103F03RC)
TS_C6_A  value 10k  [R_0402]  (hidden comment: NCP15XH103F03RC)
TS_C6_B  value 10k  [R_0402]  (hidden comment: NCP15XH103F03RC)
TS_C7_A  value 10k  [R_0402]  (hidden comment: NCP15XH103F03RC)
TS_C7_B  value 10k  [R_0402]  (hidden comment: NCP15XH103F03RC)
TS_C8_A  value 10k  [R_0402]  (hidden comment: NCP15XH103F03RC)
TS_C8_B  value 10k  [R_0402]  (hidden comment: NCP15XH103F03RC)
TS_C9_A  value 10k  [R_0402]  (hidden comment: NCP15XH103F03RC)
TS_C9_B  value 10k  [R_0402]  (hidden comment: NCP15XH103F03RC)
TS_C10_A  value 10k  [R_0402]  (hidden comment: NCP15XH103F03RC)
TS_C10_B  value 10k  [R_0402]  (hidden comment: NCP15XH103F03RC)
TS_C11_A  value 10k  [R_0402]  (hidden comment: NCP15XH103F03RC)
TS_C11_B  value 10k  [R_0402]  (hidden comment: NCP15XH103F03RC)
TS_C12_A  value 10k  [R_0402]  (hidden comment: NCP15XH103F03RC)
TS_C12_B  value 10k  [R_0402]  (hidden comment: NCP15XH103F03RC)
TS_C13_B  value 10k  [R_0402]  (hidden comment: NCP15XH103F03RC)
TS_C13A  value 10k  [R_0402]  (hidden comment: NCP15XH103F03RC)
TS_C14_A  value 10k  [R_0402]  (hidden comment: NCP15XH103F03RC)
TS_C14_B  value 10k  [R_0402]  (hidden comment: NCP15XH103F03RC)
TSQ1a  2N7002  [TO-236AB]
TSQ1b  2N7002  [TO-236AB]
U0  GD32F405RGT6  [QFP-64-P0.5MM]
U100  GD32F103CBT6  [QFP-48-P0.5MM]
U200  LM5008MMX/NOPB  [SOP65P490X110-8N]
U300  74HC4067PW,118  [TSSOP-24-P0.65MM-W4.4MM]
U500  74HC4067PW,118  [TSSOP-24-P0.65MM-W4.4MM]
U600  L78M05ABDT-TR  [TO-252AA]
U700  AMS1117-3.3  [TO-261AA]
U800  INA199A1DCKR  [SOT-353-6]
U900  74HC4067PW,118  [TSSOP-24-P0.65MM-W4.4MM]
Y100  X50328MSB2GI  value 8MHz  [YSX530GA]

## Nets
+3V3: C102.2 C103.2 C104.2 C800.1 D0.2(A) L100.2 Q_3V3.2(S) R106.2 U0.1(VBAT) U0.19(VDD) U0.32(VDD) U0.48(VDD) U0.64(VDD) U100.1(VBAT) U100.24(VDD_1) U100.36(VDD_2) U100.48(VDD_3) U700.2(VOUT) U800.3(V+)
+5V: C601.2 C602.2 C603.2 C700.2 C701.2 C702.2 D_USB.1(K) R3V0.2 U700.3(VIN)
+12V: C202.2 C204.1 C205.1 C206.1 C207.1 C208.1 C209.1 C210.1 C211.1 C600.2 L200.2 R203.1 U600.1(VIN)
CELL14: C14_Q1.2(S) C14_Q1R1.1 C212.2 C213.2 C214.2 C215.2 D201.1(K) J7.3 Q200.2(S) Q_HTR2.3(D) QB_14.2(S) QBD_1B.2(D) QBD_2B.2(D) QBD_3B.2(D) QBD_4B.2(D) QBD_5B.2(D) QBD_6B.2(D) QBD_7B.2(D) R204.1 RBS_14.1
GND: C1_Q2.2(S) C1_Q2R.2 C1_R6.2 C2_Q2.2(S) C2_Q2R.2 C2_R6.2 C3_Q2.2(S) C3_Q2R.2 C3_R6.2 C4_Q2.2(S) C4_Q2R.2 C4_R6.2 C5_Q2.2(S) C5_Q2R.2 C5_R6.2 C6_Q2.2(S) C6_Q2R.2 C6_R6.2 C7_Q2.2(S) C7_Q2R.2 C7_R6.2 C8_Q2.2(S) C8_Q2R.2 C8_R6.2 C9_Q2.2(S) C9_Q2R.2 C9_R6.2 C10_Q2.2(S) C10_Q2R.2 C10_R6.2 C11_Q2.2(S) C11_Q2R.2 C11_R6.2 C12_Q2.2(S) C12_Q2R.2 C12_R6.2 C13_Q2.2(S) C13_Q2R.2 C13_R6.2 C14_Q2.2(S) C14_Q2R.2 C14_R6.2 C100.1 C101.1 C102.1 C103.1 C104.1 C106.1 C107.1 C108.1 C201.2 C204.2 C205.2 C206.2 C207.2 C208.2 C209.2 C210.2 C211.2 C212.1 C213.1 C214.1 C215.1 C300.1 C500.1 C600.1 C601.1 C602.1 C603.1 C700.1 C701.1 C702.1 C800.2 C801.1 C802.2 C900.1 D200.2(A) J100.0(SHLD) J100.A1_B12(GND) J100.A12_B1(GND) J?.M LED_1.1(K) LED_2.1(K) LED_3.1(K) LED_4.1(K) Q201.2(S) Q_HTR2.2(S) QBEN.2(S) QBENR.2 QBG_1.2(S) QBG_2.2(S) QBG_3.2(S) QBG_4.2(S) QBG_5.2(S) QBG_6.2(S) QBG_7.2(S) QBG_8.2(S) QBG_9.2(S) QBG_10.2(S) QBG_11.2(S) QBG_12.2(S) QBG_13.2(S) QBG_14.2(S) R102.1 R108.2 R109.2 R110.2 R201.1 R202.1 R206.2 R_QHTR3.2 R_VBUS3.1 U0.18(VSS) U0.60(BOOT0) U0.63(VSS) U100.23(VSS_1) U100.35(VSS_2) U100.44(BOOT0) U100.47(VSS_3) U200.4(RTN) U300.12(VSS) U500.12(VSS) U600.2(GND) U700.1(GND) U800.2(GND) U900.12(VSS)
3V3_EN: 3V3R2.2 U0.3(PC14-OSC32_IN) U100.3(PC14-OSC32_IN)
+3V3_SW: 3V3R1.1 C300.2 C500.2 C900.2 Q_3V3.3(D) R300.2 R900.2 RT_0.2 RT_1.2 RT_2.2 RT_3.2 RT_4.2 RT_5.2 RT_6.2 RT_7.2 RT_8.2 RT_9.2 RT_10.2 RT_11.2 RT_12.2 RT_13.2 RT_14.2 U300.24(VCC) U500.24(VCC) U900.24(VCC)
^PB2_BOOT1: R110.1 SW1.1 U0.28(PB2) U100.20(PB2)
A_GND: C105.1 C501.1 R102.2 TSQ1a.2(S) TSQ1b.2(S) U0.12(VSSA) U100.8(VSSA)
B-: C1_R8.1 C1_R11.1 J1.1 R800.1 R802.1
B_SCL: U0.58(PB6) U100.42(PB6)
B_SDA: U0.59(PB7) U100.43(PB7)
BAL_CELL1: C1_R6.1 QBG_1.1(G) U900.9(Y0)
BAL_CELL2: C2_R6.1 QBG_2.1(G) U900.8(Y1)
BAL_CELL3: C3_R6.1 QBG_3.1(G) U900.7(Y2)
BAL_CELL4: C4_R6.1 QBG_4.1(G) U900.6(Y3)
BAL_CELL5: C5_R6.1 QBG_5.1(G) U900.5(Y4)
BAL_CELL6: C6_R6.1 QBG_6.1(G) U900.4(Y5)
BAL_CELL7: C7_R6.1 QBG_7.1(G) U900.3(Y6)
BAL_CELL8: C8_R6.1 QBG_8.1(G) U900.2(Y7)
BAL_CELL9: C9_R6.1 QBG_9.1(G) U900.23(Y8)
BAL_CELL10: C10_R6.1 QBG_10.1(G) U900.22(Y9)
BAL_CELL11: C11_R6.1 QBG_11.1(G) U900.21(Y10)
BAL_CELL12: C12_R6.1 QBG_12.1(G) U900.20(Y11)
BAL_CELL13: C13_R6.1 QBG_13.1(G) U900.19(Y12)
BAL_CELL14: C14_R6.1 QBG_14.1(G) U900.18(Y13)
BATT_EN: QBEN.1(G) QBENR.1 U0.29(PB10) U100.21(PB10)
BG_1: QBG_1.3(D) RBG_1.2
BG_2: QBG_2.3(D) RBG_2.2
BG_3: QBG_3.3(D) RBG_3.2
BG_4: QBG_4.3(D) RBG_4.2
BG_5: QBG_5.3(D) RBG_5.2
BG_6: QBG_6.3(D) RBG_6.2
BG_7: QBG_7.3(D) RBG_7.2
BG_8: QBG_8.3(D) RBG_8.2
BG_9: QBG_9.3(D) RBG_9.2
BG_10: QBG_10.3(D) RBG_10.2
BG_11: QBG_11.3(D) RBG_11.2
BG_12: QBG_12.3(D) RBG_12.2
BG_13: QBG_13.3(D) RBG_13.2
BG_14: QBG_14.3(D) RBG_14.2
C1_SENSE: C1_Q2.1(G) C1_Q2R.1 U300.9(Y0)
C2_SENSE: C2_Q2.1(G) C2_Q2R.1 U300.8(Y1)
C3_SENSE: C3_Q2.1(G) C3_Q2R.1 U300.7(Y2)
C4_SENSE: C4_Q2.1(G) C4_Q2R.1 U300.6(Y3)
C5_SENSE: C5_Q2.1(G) C5_Q2R.1 U300.5(Y4)
C6_SENSE: C6_Q2.1(G) C6_Q2R.1 U300.4(Y5)
C7_SENSE: C7_Q2.1(G) C7_Q2R.1 U300.3(Y6)
C8_SENSE: C8_Q2.1(G) C8_Q2R.1 U300.2(Y7)
C9_SENSE: C9_Q2.1(G) C9_Q2R.1 U300.23(Y8)
C10_SENSE: C10_Q2.1(G) C10_Q2R.1 U300.22(Y9)
C11_SENSE: C11_Q2.1(G) C11_Q2R.1 U300.21(Y10)
C12_SENSE: C12_Q2.1(G) C12_Q2R.1 U300.20(Y11)
C13_SENSE: C13_Q2.1(G) C13_Q2R.1 U300.19(Y12)
C14_SENSE: C14_Q2.1(G) C14_Q2R.1 U300.18(Y13)
CAN_RX: U0.61(PB8) U100.45(PB8)
CAN_TX: U0.62(PB9) U100.46(PB9)
CC1: J100.A5(CC1) R108.1
CC2: J100.B5(CC2) R109.1
CELL1: C1_Q1.2(S) C1_QR1.1 C2_R8.2 C2_R11.1 J1.2 J1.4 QB_1.2(S) RBS_1.1
CELL2: C2_Q1.2(S) C2_QR1.1 C3_R8.2 C3_R11.1 J1.3 J2.1 QB_2.2(S) RBS_2.1
CELL3: C3_Q1.2(S) C3_QR1.1 C4_R8.2 C4_R11.1 J2.2 J2.4 QB_3.2(S) RBS_3.1
CELL4: C4_Q1.2(S) C4_QR1.1 C5_R8.2 C5_R11.1 J2.3 J3.1 QB_4.2(S) RBS_4.1
CELL5: C5_Q1.2(S) C5_QR1.1 C6_R8.2 C6_R11.1 J3.2 J3.4 QB_5.2(S) RBS_5.1
CELL6: C6_Q1.2(S) C6_QR1.1 C7_R8.2 C7_R11.1 J3.3 J4.1 QB_6.2(S) RBS_6.1
CELL7: C7_Q1.2(S) C7_QR1.1 C8_R8.2 C8_R11.1 J4.2 J4.4 QB_7.2(S) RBS_7.1
CELL8: C8_Q1.2(S) C8_QR1.1 C9_R8.2 C9_R11.1 J4.3 J5.1 QB_8.2(S) RBS_8.1
CELL9: C9_Q1.2(S) C9_QR1.1 C10_R8.2 C10_R11.1 J5.2 J5.4 QB_9.2(S) RBS_9.1
CELL10: C10_Q1.2(S) C10_QR1.1 C11_R8.2 C11_R11.1 J5.3 J6.1 QB_10.2(S) RBS_10.1
CELL11: C11_Q1.2(S) C11_QR1.1 C12_R8.2 C12_R11.1 J6.2 J6.4 QB_11.2(S) RBS_11.1
CELL12: C12_Q1.2(S) C12_QR1.1 C13_R8.2 C13_R11.1 J6.3 J7.1 QB_12.2(S) RBS_12.1
CELL13: C13_Q1.2(S) C14_R8.2 C14_R11.1 C15_QR1.1 J7.2 J7.4 QB_13.2(S) RBS_13.1
CELL_SUM_V_FILTER: U0.27(PB1) U100.19(PB1)
CELL_VSENSE: C1_RSNS.2 C2_RSNS.2 C3_RSNS.2 C4_RSNS.2 C5_RSNS.2 C6_RSNS.2 C7_RSNS.2 C8_RSNS.2 C9_RSNS.2 C10_RSNS.2 C11_RSNS.2 C12_RSNS.2 C13_RSNS.2 C14_RSNS.2
COS: U0.22(PA6) U100.16(PA6)
CS: U0.20(PA4) U100.14(PA4) U800.6(OUT)
CS_REF: U0.17(PA3) U100.13(PA3) U800.1(REF)
DATA_BUS_A0: U0.56(PB4) U100.40(PB4) U300.10(S0) U500.10(S0) U900.10(S0)
DATA_BUS_A1: U0.57(PB5) U100.41(PB5) U300.11(S1) U500.11(S1) U900.11(S1)
DATA_BUS_A2: U0.50(PA15) U100.38(PA15) U300.14(S2) U500.14(S2) U900.14(S2)
DATA_BUS_A3: U0.55(PB3) U100.39(PB3) U300.13(S3) U500.13(S3) U900.13(S3)
EN_BAL: U0.33(PB12) U100.25(PB12) U900.15(E)
EN_V_ADC: U0.34(PB13) U100.26(PB13) U300.15(E)
EXCITER_DRV: U0.43(PA10) U100.31(PA10)
GQBD: DBD_2.2(A) GQBDR.2 QBD_1A.1(G) QBD_1B.1(G) QBD_2A.1(G) QBD_2B.1(G) QBD_3A.1(G) QBD_3B.1(G) QBD_4A.1(G) QBD_4B.1(G) QBD_5A.1(G) QBD_5B.1(G) QBD_6A.1(G) QBD_6B.1(G) QBD_7A.1(G) QBD_7B.1(G) RBEN.2
GQS: DBD_1.1(K) GQBDR.1 QBD_1A.3(S) QBD_1B.3(S) QBD_2A.3(S) QBD_2B.3(S) QBD_3A.3(S) QBD_3B.3(S) QBD_4A.3(S) QBD_4B.3(S) QBD_5A.3(S) QBD_5B.3(S) QBD_6A.3(S) QBD_6B.3(S) QBD_7A.3(S) QBD_7B.3(S)
HTR_EN: Q_HTR2.1(G) R_QHTR3.1 U0.30(PB11) U100.22(PB11)
LED_1: RLED_1.2 U0.15(PA1) U100.11(PA1)
LED_2: RLED_2.2 U0.16(PA2) U100.12(PA2)
LED_3: RLED_3.2 U0.41(PA8) U100.29(PA8)
LED_4: RLED_4.2 U0.42(PA9) U100.30(PA9)
NRST: C106.2 U0.7(~{RST}) U100.7(NRST)
PACK+: J?.PLUS(+) QBD_1A.2(D) QBD_2A.2(D) QBD_3A.2(D) QBD_4A.2(D) QBD_5A.2(D) QBD_6A.2(D) QBD_7A.2(D) R_VBUS1.2
PACK-: J?.MINUS(-) R800.2 R801.1
PFET: D20.2(A) Q201.3(D) R205.2
SG_1: C1_Q2.3(D) C1_QR2.2
SG_2: C2_Q2.3(D) C2_QR2.2
SG_3: C3_Q2.3(D) C3_QR2.2
SG_4: C4_Q2.3(D) C4_QR2.2
SG_5: C5_Q2.3(D) C5_QR2.2
SG_6: C6_Q2.3(D) C6_QR2.2
SG_7: C7_Q2.3(D) C7_QR2.2
SG_8: C8_Q2.3(D) C8_QR2.2
SG_9: C9_Q2.3(D) C9_QR2.2
SG_10: C10_Q2.3(D) C10_QR2.2
SG_11: C11_Q2.3(D) C11_QR2.2
SG_12: C12_Q2.3(D) C12_QR2.2
SG_13: C13_Q2.3(D) C13_QR2.2
SG_14: C14_Q1R2.2 C14_Q2.3(D)
SIN: U0.23(PA7) U100.17(PA7)
SRN: C801.2 C803.1 R801.2 U800.5(IN-)
SRP: C802.1 C803.2 R802.2 U800.4(IN+)
SWCLK: J100.A8(SBU1) U0.49(PA14) U100.37(PA14)
SWDIO: J100.B8(SBU2) U0.46(PA13) U100.34(PA13)
TS_0: RT_0.1 TS_C1_A.2 TS_C1_B.2 U500.9(Y0)
TS_1: RT_1.1 TS_C2_A.2 TS_C2_B.2 U500.8(Y1)
TS_2: RT_2.1 TS_C3_A.2 TS_C3_B.2 U500.7(Y2)
TS_3: RT_3.1 TS_C4_A.2 TS_C4_B.2 U500.6(Y3)
TS_4: RT_4.1 TS_C5_A.2 TS_C5_B.2 U500.5(Y4)
TS_5: RT_5.1 TS_C6_A.2 TS_C6_B.2 U500.4(Y5)
TS_6: RT_6.1 TS_C7_A.2 TS_C7_B.2 U500.3(Y6)
TS_7: RT_7.1 TS_C8_A.2 TS_C8_B.2 U500.2(Y7)
TS_8: RT_8.1 TS_C9_A.2 TS_C9_B.2 U500.23(Y8)
TS_9: RT_9.1 TS_C10_A.2 TS_C10_B.2 U500.22(Y9)
TS_10: RT_10.1 TS_C11_A.2 TS_C11_B.2 U500.21(Y10)
TS_11: RT_11.1 TS_C12_A.2 TS_C12_B.2 U500.20(Y11)
TS_12: RT_12.1 TS_C13_B.2 TS_C13A.2 U500.19(Y12)
TS_13: RT_13.1 TS_C14_A.2 TS_C14_B.2 U500.18(Y13)
TS_14: RT_14.1 U500.17(Y14)
TS_15: NT2.1 U500.16(Y15)
TS_A_GND: TS_C1_A.1 TS_C2_A.1 TS_C3_A.1 TS_C4_A.1 TS_C5_A.1 TS_C6_A.1 TS_C7_A.1 TS_C8_A.1 TS_C9_A.1 TS_C10_A.1 TS_C11_A.1 TS_C12_A.1 TS_C13A.1 TS_C14_A.1 TSQ1a.3(D)
TS_B_GND: TS_C1_B.1 TS_C2_B.1 TS_C3_B.1 TS_C4_B.1 TS_C5_B.1 TS_C6_B.1 TS_C7_B.1 TS_C8_B.1 TS_C9_B.1 TS_C10_B.1 TS_C11_B.1 TS_C12_B.1 TS_C13_B.1 TS_C14_B.1 TSQ1b.3(D)
TS_EN_A: D1.2(A) TSQ1a.1(G) U0.35(PB14) U100.27(PB14)
TS_EN_B: D2.2(A) TSQ1b.1(G) U0.36(PB15) U100.28(PB15)
TS_EN_MUX: D1.1(K) D2.1(K) U500.15(E)
TS_MULTIPLEXED: R500.2 U500.1(Z)
TS_MUX_FILTERED: C501.2 R500.1 U0.26(PB0) U100.18(PB0)
USB_DM: J100.A7(D1_N) J100.B7(D2_N) R100.1
USB_DM_R: R100.2 U0.44(PA11) U100.32(PA11)
USB_DP: J100.A6(D1_P) J100.B6(D2_P) R101.1
USB_DP_R: R101.2 R106.1 U0.45(PA12) U100.33(PA12)
VBUS_SNS: R_VBUS2.1 R_VBUS3.2 U0.21(PA5) U100.15(PA5)
VCC_3V3_SW: NT2.2
VCC_USB: D_USB.2(A) J100.A4_B9(VBUS) J100.A9_B4(VBUS)
VDDA: C105.2 L100.1 U0.13(VDDA) U100.9(VDDA)
WAKEUP_D_R: R111.2 U0.14(PA0-WKUP) U100.10(PA0-WKUP)
WAKEUP_R: Q201.1(G) R111.1 R206.1
XOSC_IN: C100.2 U0.5(PH0-OSC_IN) U100.5(PD0-OSC_IN) Y100.1
XOSC_OUT: C101.2 U0.6(PH1-OSC_OUT) U100.6(PD1-OSC_OUT) Y100.2
Net3V3R1_2: 3V3R1.2 3V3R2.1 Q_3V3.1(G)
NetC1_D1_1: C1_D1.1(K) C1_Q1.1(G) C1_QR1.2 C1_QR2.1
NetC1_D1_2: C1_D1.2(A) C1_Q1.3(D) C1_RSNS.1
NetC1_D5_1: C1_D5.1(K) QB_1.1(G) RBG_1.1 RBS_1.2
NetC1_D5_2: C1_D5.2(A) C1_R9.1 C1_R10.1 QB_1.3(D)
NetC1_R8_2: C1_R8.2 C1_R9.2 C1_R10.2 C1_R11.2
NetC2_D1_1: C2_D1.1(K) C2_Q1.1(G) C2_QR1.2 C2_QR2.1
NetC2_D1_2: C2_D1.2(A) C2_Q1.3(D) C2_RSNS.1
NetC2_D5_1: C2_D5.1(K) QB_2.1(G) RBG_2.1 RBS_2.2
NetC2_D5_2: C2_D5.2(A) C2_R9.1 C2_R10.1 QB_2.3(D)
NetC2_R8_1: C2_R8.1 C2_R9.2 C2_R10.2 C2_R11.2
NetC3_D1_1: C3_D1.1(K) C3_Q1.1(G) C3_QR1.2 C3_QR2.1
NetC3_D1_2: C3_D1.2(A) C3_Q1.3(D) C3_RSNS.1
NetC3_D5_1: C3_D5.1(K) QB_3.1(G) RBG_3.1 RBS_3.2
NetC3_D5_2: C3_D5.2(A) C3_R9.1 C3_R10.1 QB_3.3(D)
NetC3_R8_1: C3_R8.1 C3_R9.2 C3_R10.2 C3_R11.2
NetC4_D1_1: C4_D1.1(K) C4_Q1.1(G) C4_QR1.2 C4_QR2.1
NetC4_D1_2: C4_D1.2(A) C4_Q1.3(D) C4_RSNS.1
NetC4_D5_1: C4_D5.1(K) QB_4.1(G) RBG_4.1 RBS_4.2
NetC4_D5_2: C4_D5.2(A) C4_R9.1 C4_R10.1 QB_4.3(D)
NetC4_R8_1: C4_R8.1 C4_R9.2 C4_R10.2 C4_R11.2
NetC5_D1_1: C5_D1.1(K) C5_Q1.1(G) C5_QR1.2 C5_QR2.1
NetC5_D1_2: C5_D1.2(A) C5_Q1.3(D) C5_RSNS.1
NetC5_D5_1: C5_D5.1(K) QB_5.1(G) RBG_5.1 RBS_5.2
NetC5_D5_2: C5_D5.2(A) C5_R9.1 C5_R10.1 QB_5.3(D)
NetC5_R8_1: C5_R8.1 C5_R9.2 C5_R10.2 C5_R11.2
NetC6_D1_1: C6_D1.1(K) C6_Q1.1(G) C6_QR1.2 C6_QR2.1
NetC6_D1_2: C6_D1.2(A) C6_Q1.3(D) C6_RSNS.1
NetC6_D5_1: C6_D5.1(K) QB_6.1(G) RBG_6.1 RBS_6.2
NetC6_D5_2: C6_D5.2(A) C6_R9.1 C6_R10.1 QB_6.3(D)
NetC6_R8_1: C6_R8.1 C6_R9.2 C6_R10.2 C6_R11.2
NetC7_D1_1: C7_D1.1(K) C7_Q1.1(G) C7_QR1.2 C7_QR2.1
NetC7_D1_2: C7_D1.2(A) C7_Q1.3(D) C7_RSNS.1
NetC7_D5_1: C7_D5.1(K) QB_7.1(G) RBG_7.1 RBS_7.2
NetC7_D5_2: C7_D5.2(A) C7_R9.1 C7_R10.1 QB_7.3(D)
NetC7_R8_1: C7_R8.1 C7_R9.2 C7_R10.2 C7_R11.2
NetC8_D1_1: C8_D1.1(K) C8_Q1.1(G) C8_QR1.2 C8_QR2.1
NetC8_D1_2: C8_D1.2(A) C8_Q1.3(D) C8_RSNS.1
NetC8_D5_1: C8_D5.1(K) QB_8.1(G) RBG_8.1 RBS_8.2
NetC8_D5_2: C8_D5.2(A) C8_R9.1 C8_R10.1 QB_8.3(D)
NetC8_R8_1: C8_R8.1 C8_R9.2 C8_R10.2 C8_R11.2
NetC9_D1_1: C9_D1.1(K) C9_Q1.1(G) C9_QR1.2 C9_QR2.1
NetC9_D1_2: C9_D1.2(A) C9_Q1.3(D) C9_RSNS.1
NetC9_D5_1: C9_D5.1(K) QB_9.1(G) RBG_9.1 RBS_9.2
NetC9_D5_2: C9_D5.2(A) C9_R9.1 C9_R10.1 QB_9.3(D)
NetC9_R8_1: C9_R8.1 C9_R9.2 C9_R10.2 C9_R11.2
NetC10_D1_1: C10_D1.1(K) C10_Q1.1(G) C10_QR1.2 C10_QR2.1
NetC10_D1_2: C10_D1.2(A) C10_Q1.3(D) C10_RSNS.1
NetC10_D5_1: C10_D5.1(K) QB_10.1(G) RBG_10.1 RBS_10.2
NetC10_D5_2: C10_D5.2(A) C10_R9.1 C10_R10.1 QB_10.3(D)
NetC10_R8_1: C10_R8.1 C10_R9.2 C10_R10.2 C10_R11.2
NetC11_D1_1: C11_D1.1(K) C11_Q1.1(G) C11_QR1.2 C11_QR2.1
NetC11_D1_2: C11_D1.2(A) C11_Q1.3(D) C11_RSNS.1
NetC11_D5_1: C11_D5.1(K) QB_11.1(G) RBG_11.1 RBS_11.2
NetC11_D5_2: C11_D5.2(A) C11_R9.1 C11_R10.1 QB_11.3(D)
NetC11_R8_1: C11_R8.1 C11_R9.2 C11_R10.2 C11_R11.2
NetC12_D1_1: C12_D1.1(K) C12_Q1.1(G) C12_QR1.2 C12_QR2.1
NetC12_D1_2: C12_D1.2(A) C12_Q1.3(D) C12_RSNS.1
NetC12_D5_1: C12_D5.1(K) QB_12.1(G) RBG_12.1 RBS_12.2
NetC12_D5_2: C12_D5.2(A) C12_R9.1 C12_R10.1 QB_12.3(D)
NetC12_R8_1: C12_R8.1 C12_R9.2 C12_R10.2 C12_R11.2
NetC13_D1_1: C13_D1.1(K) C13_Q1.1(G) C13_QR2.1 C15_QR1.2
NetC13_D1_2: C13_D1.2(A) C13_Q1.3(D) C13_RSNS.1
NetC13_D5_1: C13_D5.1(K) QB_13.1(G) RBG_13.1 RBS_13.2
NetC13_D5_2: C13_D5.2(A) C13_R9.1 C13_R10.1 QB_13.3(D)
NetC13_R8_1: C13_R8.1 C13_R9.2 C13_R10.2 C13_R11.2
NetC14_D1_1: C14_D1.1(K) C14_Q1.1(G) C14_Q1R1.2 C14_Q1R2.1
NetC14_D1_2: C14_D1.2(A) C14_Q1.3(D) C14_RSNS.1
NetC14_D5_1: C14_D5.1(K) QB_14.1(G) RBG_14.1 RBS_14.2
NetC14_D5_2: C14_D5.2(A) C14_R9.1 C14_R10.1 QB_14.3(D)
NetC14_R8_1: C14_R8.1 C14_R9.2 C14_R10.2 C14_R11.2
NetC107_2: C107.2 U0.47(VCAP_2)
NetC108_2: C108.2 U0.31(VCAP_1)
NetC200_1: C200.1 U200.2(BST)
NetC200_2: C200.2 D200.1(K) L200.1 U200.1(SW)
NetC201_1: C201.1 U200.7(VCC)
NetC202_1: C202.1 R202.2 R203.2 U200.5(FB)
NetD0_1: D0.1(K) D20.1(K) SW1.2
NetD201_2: D201.2(A) Q200.1(G) R204.2 R205.1
NetDBD_1_2: DBD_1.2(A) DBD_2.1(K)
NetLED_1_2: LED_1.2(A) RLED_1.1
NetLED_2_2: LED_2.2(A) RLED_2.1
NetLED_3_2: LED_3.2(A) RLED_3.1
NetLED_4_2: LED_4.2(A) RLED_4.1
NetQ200_3: Q200.3(D) Ron_c.1 Ron_d.1 U200.8(VIN)
NetQBEN_3: QBEN.3(D) RBEN.1
NetR3V0_1: R3V0.1 U600.3(Vout)
NetR200_1: R200.1 R201.2
NetR200_2: R200.2 U200.3(RCL)
NetR300_1: R300.1 U300.1(Z)
NetR900_1: R900.1 U900.1(Z)
NetR_VBUS1_1: R_VBUS1.1 R_VBUS2.2
NetRon_a_1: Ron_a.1 Ron_b.2
NetRon_a_2: Ron_a.2 U200.6(RT/SD)
NetRon_b_1: Ron_b.1 Ron_c.2 Ron_d.2

Not connected (* = marked no-connect by the designer): U0 2(PC13-TAMPER-RTC) 4(PC15-OSC32_OUT) 8(PC0) 9(PC1) 10(PC2) 11(PC3) 24(PC4) 25(PC5) 37(PC6) 38(PC7) 39(PC8) 40(PC9) 51(PC10) 52(PC11) 53(PC12) 54(PD2); U100 2(PC13-TAMPER-RTC) 4(PC15-OSC32_OUT); U300 16(Y15) 17(Y14); U900 16(Y15) 17(Y14)

## Notes on the sheet
- (in symbol Keystone 1048) +

## Library data of the parts
3V3R1 R201 R_QHTR3 RBEN Ron_a Ron_b Ron_c Ron_d = 0402WGF1003TCE: R - RESISTOR - SMD - 100k - 1% -  0402; LCSC Part #: C25741; JLC Availability: Basic
3V3R2 C1_Q2R C1_QR1 C1_QR2 C1_R6 C1_RSNS C2_Q2R C2_QR1 C2_QR2 C2_R6 C2_RSNS C3_Q2R C3_QR1 C3_QR2 C3_R6 C3_RSNS C4_Q2R C4_QR1 C4_QR2 C4_R6 C4_RSNS C5_Q2R C5_QR1 C5_QR2 C5_R6 C5_RSNS C6_Q2R C6_QR1 C6_QR2 C6_R6 C6_RSNS C7_Q2R C7_QR1 C7_QR2 C7_R6 C7_RSNS C8_Q2R C8_QR1 C8_QR2 C8_R6 C8_RSNS C9_Q2R C9_QR1 C9_QR2 C9_R6 C9_RSNS C10_Q2R C10_QR1 C10_QR2 C10_R6 C10_RSNS C11_Q2R C11_QR1 C11_QR2 C11_R6 C11_RSNS C12_Q2R C12_QR1 C12_QR2 C12_R6 C12_RSNS C13_Q2R C13_QR2 C13_R6 C13_RSNS C14_Q1R1 C14_Q1R2 C14_Q2R C14_R6 C14_RSNS C15_QR1 GQBDR QBENR R203-R206 R_VBUS1 R_VBUS2 RBG_1-RBG_14 RBS_1-RBS_14 RT_0-RT_14 = 0402WGF1002TCE: R - RESISTOR - SMD - 10k - 1% - 0402; LCSC Part #: C25744; JLC Availability: Basic
C1_D1 C1_D5 C2_D1 C2_D5 C3_D1 C3_D5 C4_D1 C4_D5 C5_D1 C5_D5 C6_D1 C6_D5 C7_D1 C7_D5 C8_D1 C8_D5 C9_D1 C9_D5 C10_D1 C10_D5 C11_D1 C11_D5 C12_D1 C12_D5 C13_D1 C13_D5 C14_D1 C14_D5 D0-D2 D20 D_USB = 1N4148WS: D - DIODE - FAST TRR - 100V - 150mA - 4ns; LCSC Part #: C2128; JLC Availability: Basic; PIV: 100V; If: 150mA; Trr: 4ns
C1_Q1 C2_Q1 C3_Q1 C4_Q1 C5_Q1 C6_Q1 C7_Q1 C8_Q1 C9_Q1 C10_Q1 C11_Q1 C12_Q1 C13_Q1 C14_Q1 QB_1-QB_14 = AO3401A: Q - TRANSISTOR - MOSFET (P) - 30V - 1.4A - 0.44 Ohm; JLC Availability: Basic; LCSC Part #: C15127
C1_Q2 C2_Q2 C3_Q2 C4_Q2 C5_Q2 C6_Q2 C7_Q2 C8_Q2 C9_Q2 C10_Q2 C11_Q2 C12_Q2 C13_Q2 C14_Q2 Q201 Q_HTR2 QBEN QBG_1-QBG_14 TSQ1a TSQ1b = 2N7002: Q - TRANSISTOR - MOSFET (N) - 60V - 200mW; WVDC: 60; JLC Availability: Basic; LCSC Part #: C8545
C1_R8-C1_R11 C2_R8-C2_R11 C3_R8-C3_R11 C4_R8 C4_R10 C4_R11 C5_R8-C5_R11 C6_R8-C6_R11 C7_R8-C7_R11 C8_R8-C8_R11 C9_R8-C9_R11 C10_R8-C10_R11 C11_R8-C11_R11 C12_R8-C12_R11 C13_R8-C13_R11 C14_R8-C14_R11 R111 R300 R500 R801 R802 R900 = 0402WGF1000TCE: R - RESISTOR - SMD - 100R - 1% - 0402; LCSC Part #: C25076; JLC Availability: Basic
C4_R9 R110 R_VBUS3 RLED_1-RLED_4 = 0402WGF1001TCE: R - RESISTOR - SMD - 1k - 1% - 0402; LCSC Part #: C11702; JLC Availability: Basic
C100 C101 = 0402CG120J500NT: C - CAPACITOR - MLCC - 12pF - 50V - 0402; WVDC: 50; LCSC Part #: C1547; JLC Availability: Basic
C102-C104 C107 C108 C601-C603 C700-C702 = CL05A106MQ5NUNC: C - CAPACITOR - MLCC - 10uF - 6.3V - 0402; WVDC: 6.3; LCSC Part #: C15525; JLC Availability: Basic
C105 C201 C204-C211 C600 C800 = CL05A105KA5NQNC: C - CAPACITOR - MLCC - 1uF - 25V - 0402; WVDC: 16; LCSC Part #: C52923; JLC Availability: Basic
C106 C300 C500 C501 C801-C803 C900 = CL05B104KO5NNNC: C - CAPACITOR - MLCC - 100nF - 16V - 0402; WVDC: 16; LCSC Part #: C1525; JLC Availability: Basic
C200 = CL05B103KB5NNNC: C - CAPACITOR - MLCC - 10nF - 50V - 0402; WVDC: 50; LCSC Part #: C15195; JLC Availability: Basic
C202 = CL05B332KB5NNNC: C - CAPACITOR - MLCC - 3.3nF - 50V - 0402; WVDC: 50; LCSC Part #: C26404; JLC Availability: Basic
C212-C215 = 1206B105K101NT: C - CAPACITOR - MLCC - 1uF - 100V - 1206 - X7R; WVDC: 100; LCSC Part #: C91151; JLC Availability: Extended
D200 = SS210: D - DIODE - SCHOTTKY - 100V - 2A; Vrrm: 100; If: 2A; LCSC Part #: C14996; JLC Availability: Extended
D201 DBD_1 DBD_2 = ZMM5V6-M: D - DIODE - ZENER - 5.6V - 500mW; LCSC Part #: C8062; JLC Availability: BASIC
J1-J7 = Keystone 1048: J - JACK - SMT Battery Holder 18650X2 Cells
J100 = 918-418K2023S40001: J - JACK - USB - Type C - Recepticle - SMT - 90°; JLC Availability: LCSC; LCSC Part #: C167321
J? = XT60PW_F: J - JACK - POWER - XT60 - RIGHT - FEMALE; LCSC Part #: X; JLC Availability: None
L100 = SDFL1608S100KTF: L - INDUCTOR - 10uH - 0603; LCSC Part #: C1035; JLC Availability: Basic
L200 = SWRB1207S-221MT: L - INDUCTOR - 220uH - 1.6A - 12.5mm; Isat: 1.6A; LCSC Part #: C169380; JLC Availability: Extended
LED_1-LED_4 = 19-21UYC/S530-A4/TR8: D - LED - 0603 - Yellow (Sodium); LCSC Part #: C409441; JLC Availability: Extended
NT2 = NET_TIE: R - Net Tie
Q200 Q_3V3 = HSS0127: Q - TRANSISTOR - MOSFET (P) - 100V - 0.9A - 0.65 Ohm; WVDC: 100; JLC Availability: Extended; LCSC Part #: C700960
QBD_1A QBD_1B QBD_2A QBD_2B QBD_3A QBD_3B QBD_4A QBD_4B QBD_5A QBD_5B QBD_6A QBD_6B QBD_7A QBD_7B = NCE60P12K: Q - TRANSISTOR - MOSFET (P) - 60V - 12A - 0.1R; WVDC: 60; LCSC Part #: C326372; JLC Availability: Extended
R3V0 R102 = 0402WGF0000TCE: R - RESISTOR - SMD - 0R - 1% - 0402; LCSC Part #: C17168; JLC Availability: Basic
R100 R101 = 0402WGF220JTCE: R - RESISTOR - SMD - 22R - 1% - 0402; LCSC Part #: C25092; JLC Availability: Basic
R106 = 0402WGF1501TCE: R - RESISTOR - SMD - 1.5k - 1% - 0402; LCSC Part #: C25867; JLC Availability: Basic
R108 R109 = 0402WGF5101TCE: R - RESISTOR - SMD - 5.1k - 1% - 0402; LCSC Part #: C25905; JLC Availability: Basic
R200 = 0402WGF3302TCE: R - RESISTOR - SMD - 33k - 1% - 0402; LCSC Part #: C25779; JLC Availability: Basic
R202 = 0402WGF3301TCE: R - RESISTOR - SMD - 3.3k - 1% - 0402; LCSC Part #: C25890; JLC Availability: Basic
R800 = MRF6432(2512)LR001FTS: R - RESISTOR - SMD - 0.001R - 1% - 2512 - 2W; ComponentLink1URL: http://riedon.com/media/pdf/CSR.pdf; ComponentLink1Description: http://riedon.com/media/pdf/CSR.pdf; LCSC Part #: C76233; Power: 2W; JLC Availability: Extended
SW1 = TS-1187A-C-C-B: SW - SWITCH - SPST - NO - Top Actuated Surface Mount; LCSC Part #: C318889; JLC Availability: Extended
TS_C1_A TS_C1_B TS_C2_A TS_C2_B TS_C3_A TS_C3_B TS_C4_A TS_C4_B TS_C5_A TS_C5_B TS_C6_A TS_C6_B TS_C7_A TS_C7_B TS_C8_A TS_C8_B TS_C9_A TS_C9_B TS_C10_A TS_C10_B TS_C11_A TS_C11_B TS_C12_A TS_C12_B TS_C13_B TS_C13A TS_C14_A TS_C14_B = NCP15XH103F03RC: RT - NTC THERMISTOR - 10k - 1% - 0402; Value2: 3380k; LCSC Part #: C77131; JLC Availability: Extended
U0 = GD32F405RGT6: U - IC - MCU 32BIT 1MB FLASH 64LQFP; ComponentLink2Description: Datasheet; ComponentLink1URL: https://upverter.com/upn/revision/179c87d5c3d4f257/; ComponentLink1Description: Upverter; ComponentLink2URL: http://www.st.com/content/ccc/resource/technical/document/datasheet/33/d4/6f/1d/df/0b/4c/6d/CD00161566.pdf/files/CD00161566.pdf/jcr:content/translations/en.CD00161566.pdf; LCSC Part #: C99031; JLC Availability: Extended
U100 = GD32F103CBT6: U - IC - MCU, 128 KB Flash, 20 KB Internal RAM, 37 I/Os, 48-pin LQFP, -40 to 85 degC; FLASH Size (Prog) (kB): 128; I/Os (High Current): 37; Internal RAM Size (kB): 20; Operating Frequency(F) (Processor speed) (MHz): 72; ComponentLink1Description: Manufacturer URL; ComponentLink1URL: http://www.st.com/web/en/home.html; ComponentLink2Description: Datasheet; ComponentLink2URL: http://www.st.com/st-web-ui/static/active/en/resource/technical/document/datasheet/CD00161566.pdf; ComponentLink3Description: Package Specification; ComponentLink3URL: http://www.st.com/st-web-ui/static/active/en/resource/technical/document/datasheet/DM00058181.pdf; LCSC Part #: C77979; JLC Availability: Extended
U200 = LM5008MMX/NOPB: U - IC - BUCK CONVERTER, ADJUSTABLE, 95V, 350mA; Package: None; Price: None; Value: *; MP: LM5008MMX/NOPB; Availability: Unavailable
U300 U500 U900 = 74HC4067PW,118: U - IC -16 Port Analog MUX; ComponentLink1Description: Manufacturer URL; ComponentLink1URL: http://www.st.com/web/en/home.html; ComponentLink2Description: Datasheet; ComponentLink2URL: http://www.st.com/st-web-ui/static/active/en/resource/technical/document/datasheet/CD00161566.pdf; ComponentLink3Description: Package Specification; ComponentLink3URL: http://www.st.com/st-web-ui/static/active/en/resource/technical/document/datasheet/DM00058181.pdf; JLC Availability: Extended; LCSC Part #: C179326
U600 = L78M05ABDT-TR: U - IC - 5V Power Regulator; VOut: 5.0; LCSC Part #: C58069; JLC Availability: Basic
U700 = AMS1117-3.3: U - IC - LDO - 3.3V - 800mA; VOut: 3.3; LCSC Part #: C6186; JLC Availability: Basic
U800 = INA199A1DCKR: U - IC - Bidirectional Current-Sensing Amplifiers 50V/V; JLC Availability: Extended; LCSC Part #: C59135
Y100 = X50328MSB2GI: Y - RESONATOR - 8MHZ ±10PPM - SMD-5032; Availability: Basic; LCSC Part #: C115962